# Altium schematic sheet 03Sensors.SchDoc: Sensors
size A4; Organization: Altium Limited; Revision: V1.0; SheetNumber: 3; SheetTotal: 3
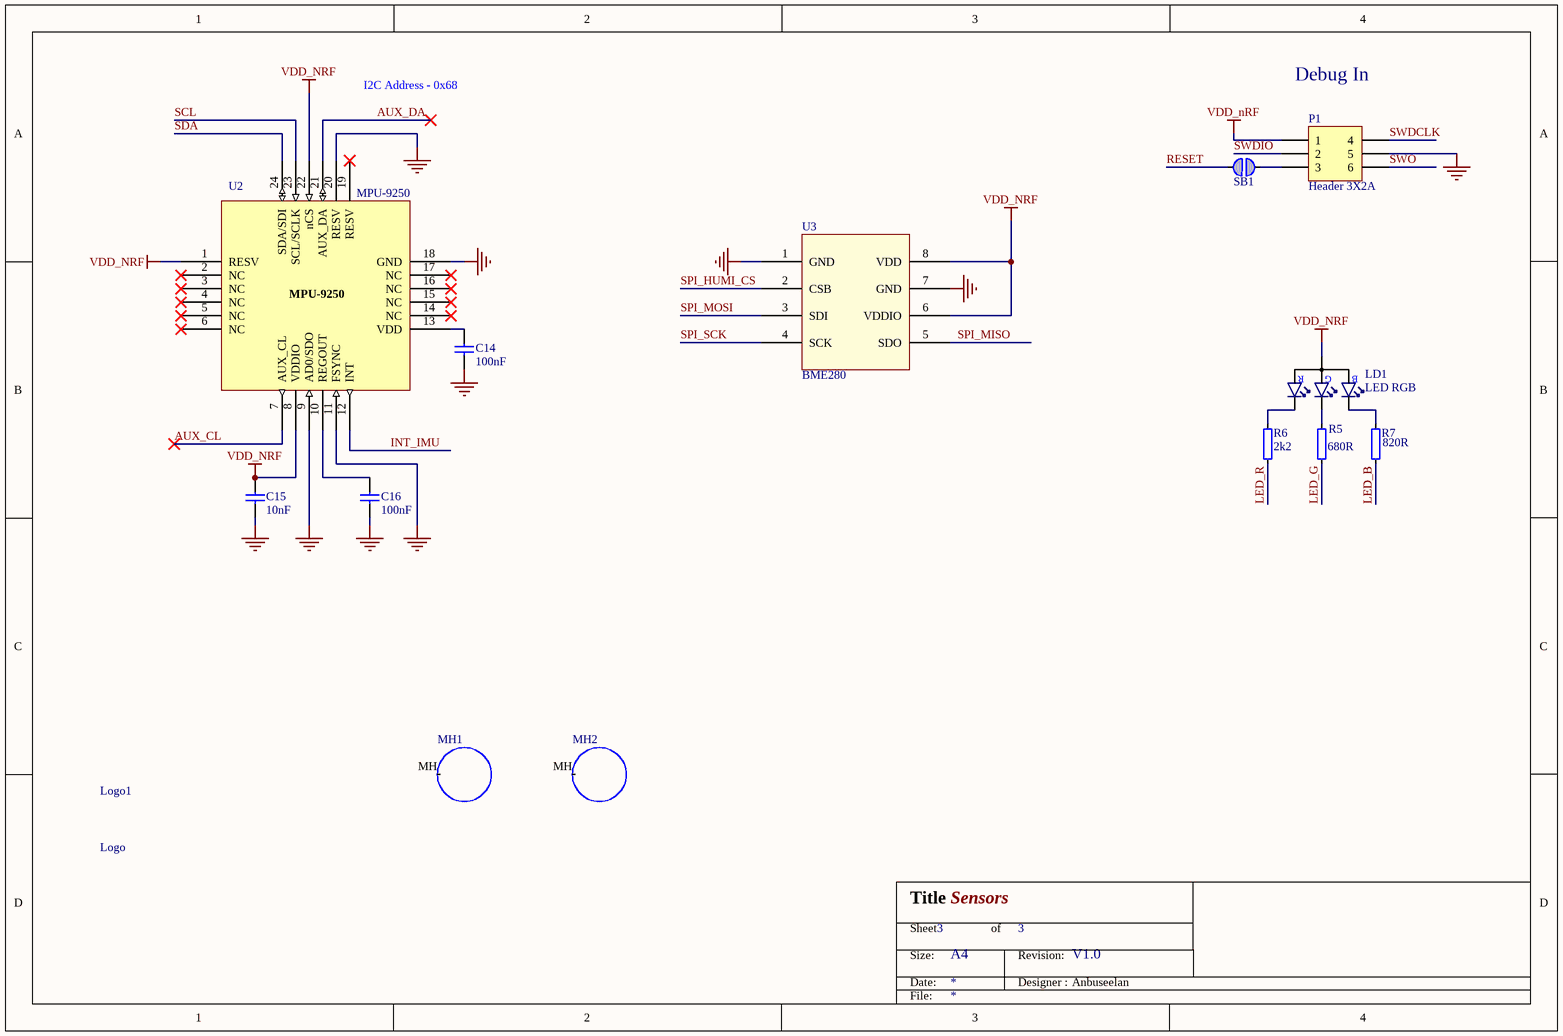
[diagram p0: 03Sensors.SchDoc]

## Parts
C14  100nF  [CAPC1005X04L]
C15  10nF  [CAPC1005X04L]
C16  100nF  [CAPC1005X04L]
LD1  LED RGB  [SML-LX0404SIUPGUSB]
Logo1  Logo  [Logo]
MH1  MH  [MH]  (value not drawn)
MH2  MH  [MH]  (value not drawn)
P1  Header 3X2A  [HDR2X3_CEN]
R5  680R  [RESC1005X04L]
R6  2k2  [RESC1005X04L]
R7  820R  [RESC1005X04L]
SB1  Solderbridge  [Solderbridge]  (value not drawn)  (no BOM)
U2  MPU-9250  [QFN40P300X300X105_HS-25N]
U3  BME280  [PSON65P250X100-8N]

## Nets
GND: C14.1 C15.1 C16.1 P1.5 U2.9(AD0/SDO) U2.11(FSYNC) U2.18(GND) U2.20(RESV) U3.1(GND) U3.7(GND)
VDD_nRF: C15.2 LD1.4(A) P1.1 U2.1(RESV) U2.8(VDDIO) U2.22(nCS) U3.6(VDDIO) U3.8(VDD)
AUX_CL: U2.7(AUX_CL)
AUX_DA: U2.21(AUX_DA)
INT_IMU: U2.12(INT)
LED_B: R7.1
LED_G: R5.1
LED_R: R6.1
RESET: SB1.2
SCL: U2.23(SCL/SCLK)
SDA: U2.24(SDA/SDI)
SPI_HUMI_CS: U3.2(CSB)
SPI_MISO: U3.5(SDO)
SPI_MOSI: U3.3(SDI)
SPI_SCK: U3.4(SCK)
SWDCLK: P1.4
SWDIO: P1.2
SWO: P1.6
NetC14_2: C14.2 U2.13(VDD)
NetC16_2: C16.2 U2.10(REGOUT)
NetLD1_1: LD1.1(C_RED) R6.2
NetLD1_2: LD1.2(C_GREEN) R5.2
NetLD1_3: LD1.3(C_BLUE) R7.2
NetP1_3: P1.3 SB1.1

Not connected (* = marked no-connect by the designer): MH1 MH; MH2 MH; U2 2(NC)* 3(NC)* 4(NC)* 5(NC)* 6(NC)* 14(NC)* 15(NC)* 16(NC)* 17(NC)* 19(RESV)*

## Notes on the sheet
- I2C Address - 0x68
- Debug In
- Title
- Size:
- Date:
- Sheet
- A4
- of
- Revision:
- Designer :
- Anbuseelan
- File:
- (in symbol D:LED_RGB) R; G; B

## Library data of the parts
C14 C16 = CAP: Capacitor, X7R, ±10%; Part Number: C0402-100n; Note: 16V; Artikkelnr Noca: 20039200; Artikkelnr Simpro: N.A.; Manufacturer: *; Manufacturer Part Number: *; Datasheet: *; Footprint Doc: 0402; LatestRevisionDate: 2009-11-23; Pin Count: 2; Publisher: Nordic Semiconductor; Published: 2009-05-08; Value: 100nF; Supplier: *; Supplier part number: *; 2nd source Supplier: *; 2nd source part number: *
C15 = CAP: Capacitor, X7R, ±10%; Part Number: C0402-10n; Note: 16V; Artikkelnr Noca: 20039166; Artikkelnr Simpro: N.A.; Manufacturer: *; Manufacturer Part Number: *; Datasheet: *; Footprint Doc: 0402; LatestRevisionDate: 2009-11-23; Pin Count: 2; Publisher: Nordic Semiconductor; Published: 2009-05-08; Value: 10nF; Supplier: *; Supplier part number: *; 2nd source Supplier: *; 2nd source part number: *
LD1 = D:LED_RGB: RGB LED 1.00 mm x 1.00 mm SMD; Manufacturer: Lumex; 2nd source part number: 211-8843; Artikkelnr Noca: 13019150; Artikkelnr Simpro: N.A.; Part Number: SML-LX0404SIUPGUSB; Manufacturer Part Number: SML-LX0404SIUPGUSB; Datasheet: http://media.digikey.com/pdf/Data%20Sheets/Lumex%20PDFs/SML-LX0404SIUPGUSB.pdf; Footprint Doc: SML-LX0404SIUPGUSB; LatestRevisionDate: 2012-10-08; Pin Count: 4; Publisher: Nordic Semiconductor; Published: 2012-10-08; Value: LED RGB; Note: *; Supplier: Digi-Key; Supplier part number: 67-2125-1-ND; 2nd source Supplier: Farnell
P1 = Header 3X2A: Header, 3-Pin, Dual row; LatestRevisionDate: 17-Jul-2002; LatestRevisionNote: Re-released for DXP Platform.; Publisher: Altium Limited
R5 = RES_1: Resistor, ±1%, 0.063W; Part Number: R0402-680; Note: Chip Res 1%; Artikkelnr Noca: 27049069; Artikkelnr Simpro: N.A.; Value Ohm: 680; Manufacturer: *; Manufacturer Part Number: *; Datasheet: *; Footprint Doc: 0402; LatestRevisionDate: 2009-11-23; Pin Count: 2; Publisher: Nordic Semiconductor; Published: 2009-05-08; Value: 680R; Supplier: Farnell; Supplier part number: 173-8848; 2nd source Supplier: *; 2nd source part number: *
R6 = RES_1: Resistor, ±1%, 0.063W; Part Number: R0402-2k2; Note: Chip Res 1%; Artikkelnr Noca: 27049081; Artikkelnr Simpro: N.A.; Value Ohm: 2200; Manufacturer: *; Manufacturer Part Number: *; Datasheet: *; Footprint Doc: 0402; LatestRevisionDate: 2009-11-23; Pin Count: 2; Publisher: Nordic Semiconductor; Published: 2009-05-08; Value: 2k2; Supplier: Farnell; Supplier part number: 173-8854; 2nd source Supplier: *; 2nd source part number: *
R7 = RES_1: Resistor, ±1%, 0.063W; Part Number: R0402-820; Note: Chip Res 1%; Artikkelnr Noca: 27049071; Artikkelnr Simpro: N.A.; Value Ohm: 820; Manufacturer: *; Manufacturer Part Number: *; Datasheet: *; Footprint Doc: 0402; LatestRevisionDate: 2009-11-23; Pin Count: 2; Publisher: Nordic Semiconductor; Published: 2009-05-08; Value: 820R; Supplier: Farnell; Supplier part number: 173-8849; 2nd source Supplier: *; 2nd source part number: *
SB1 = SOLDERBRIDGE: Artikkelnr Noca: N.A.; Part Number: Solderbridge; Manufacturer: *; Manufacturer Part Number: *; Datasheet: *; Footprint Doc: Solderbridge; LatestRevisionDate: 2009-12-14; Pin Count: 2; Publisher: Nordic Semiconductor; Published: 2009-12-14; Value: Solderbridge; Note: *; Supplier: *; Supplier part number: *; 2nd source Supplier: *; 2nd source part number: *; Artikkelnr Simpro: N.A.
U2 = MPU-9250: 9-axis MotionTracking™ Device; Manufacturer: InvenSense; Note: 3-Axis Gyro, 3-Axis Accel and 3-Axis Compass; Artikkelnr Noca: N.A.; Part Number: MPU-9250; Manufacturer Part Number: MPU-9250; Datasheet: http://43zrtwysvxb2gf29r5o0athu.wpengine.netdna-cdn.com/wp-content/uploads/2015/02/MPU-9250-Datasheet.pdf; Footprint Doc: QFN-24; LatestRevisionDate: 2015-06-24; Pin Count: 24; Publisher: Nordic Semiconductor; Published: 2015-06-24; Value: MPU-9250; Supplier: Digi-Key; Supplier part number: 1428-1019-1-ND; 2nd source Supplier: *; 2nd source part number: *; Artikkelnr Simpro: N.A.